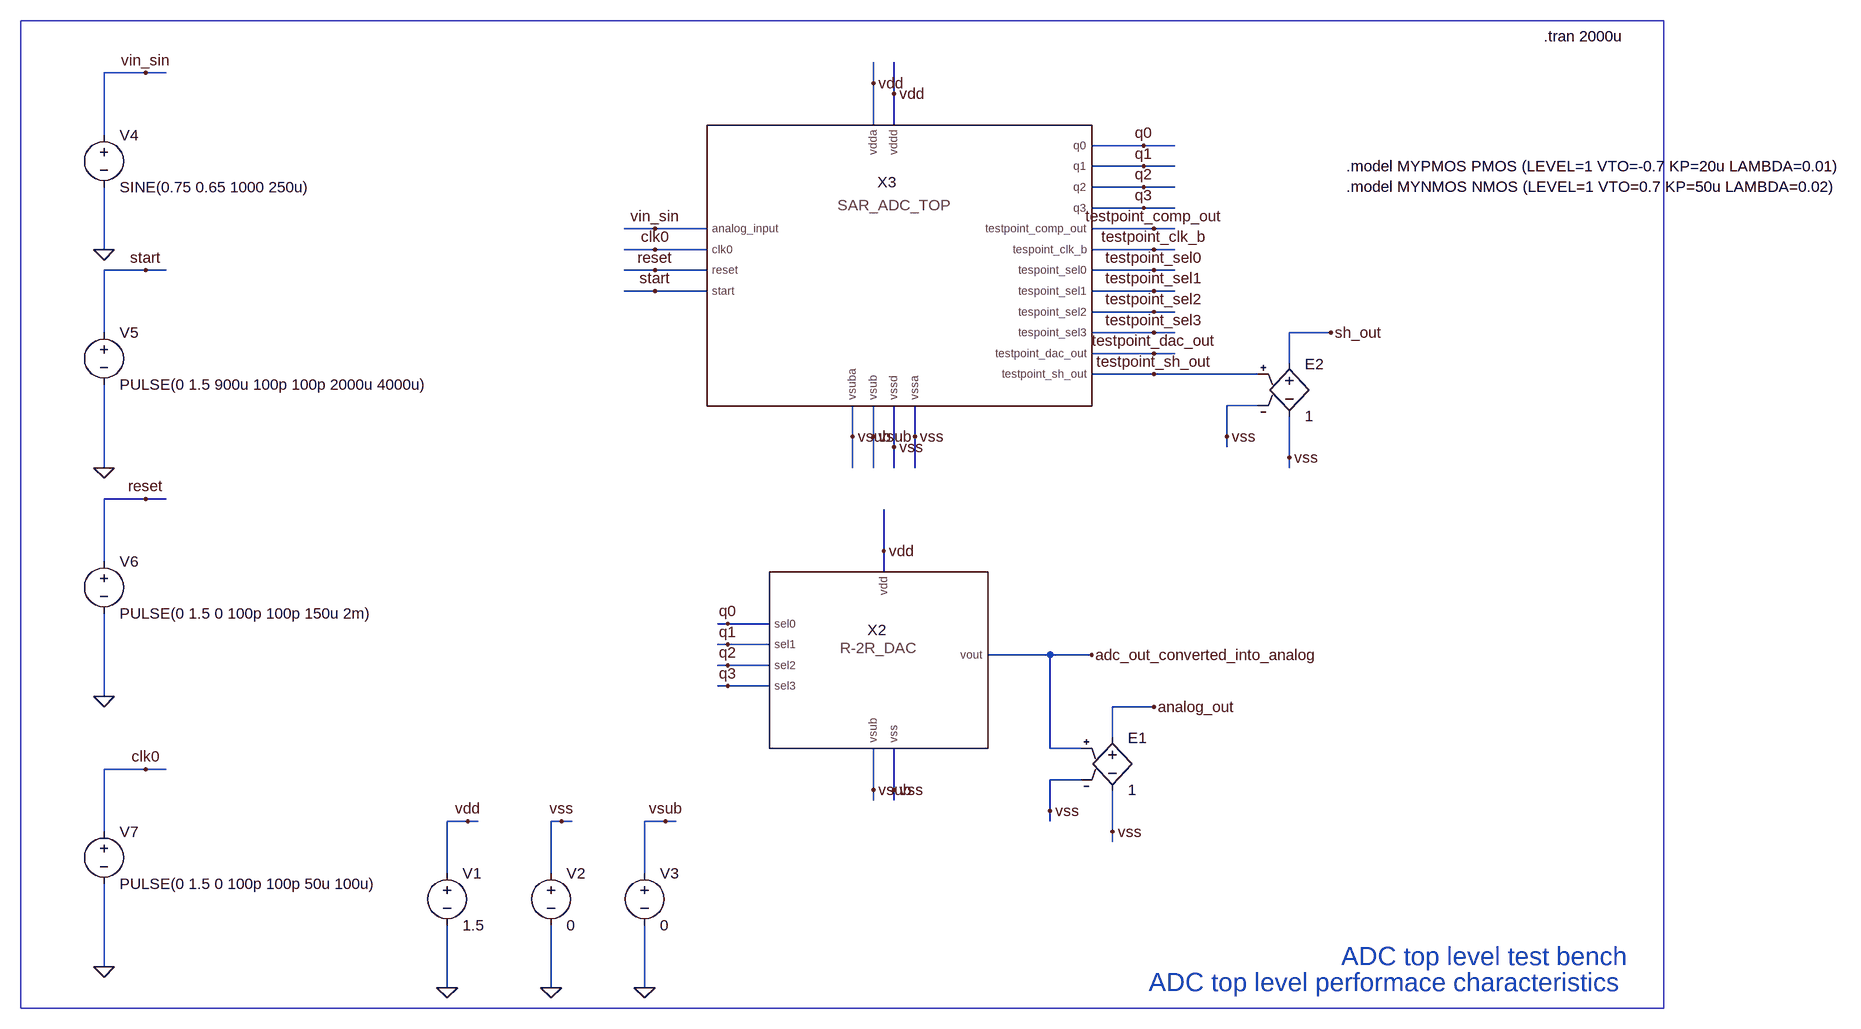
[diagram p0: schematic dsproj_adctop_perfCharacterisitcs.asc]
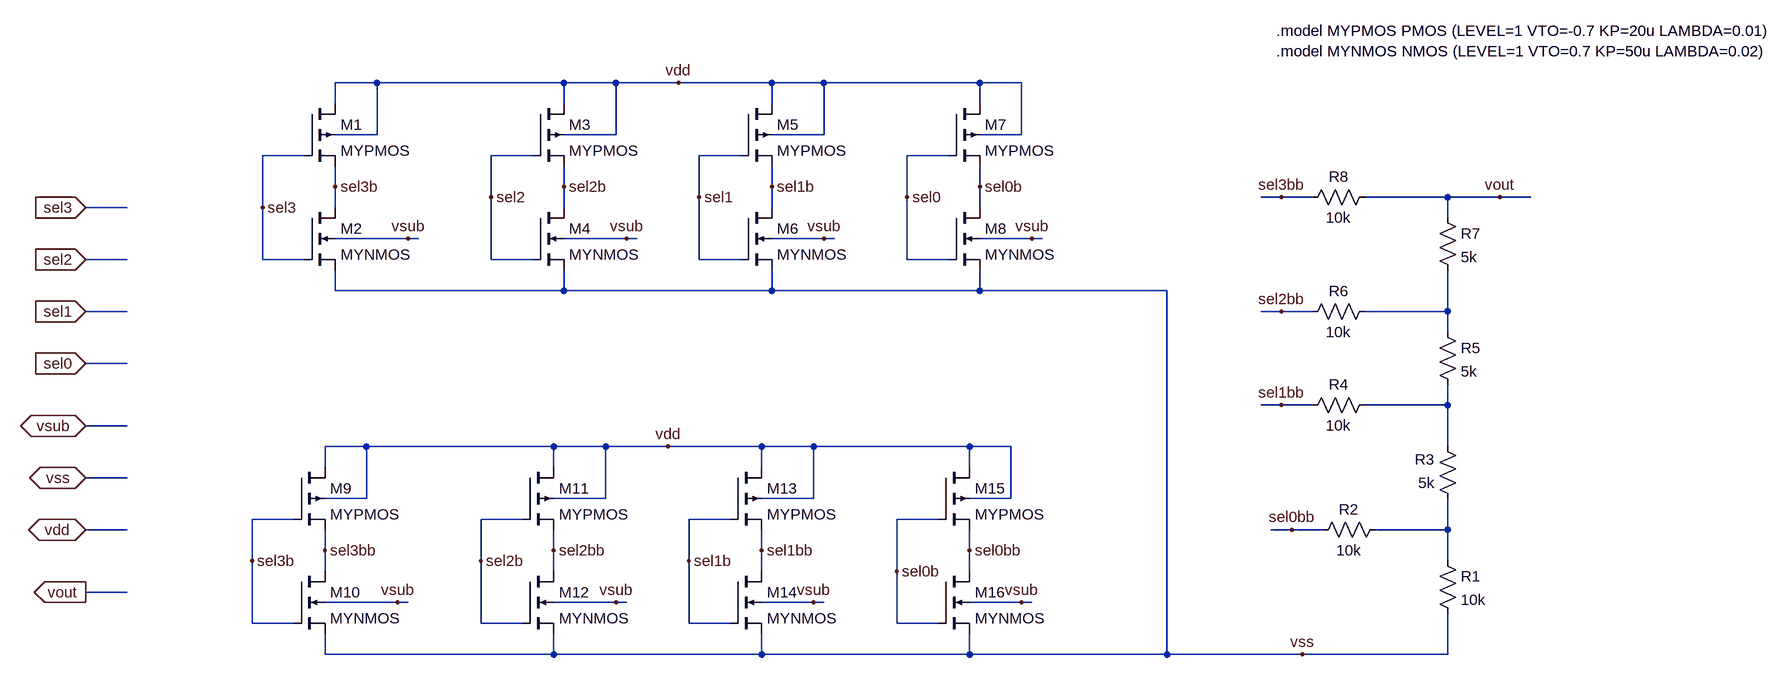
[diagram p1: sub-circuit dsproj_r2rdac.asc]
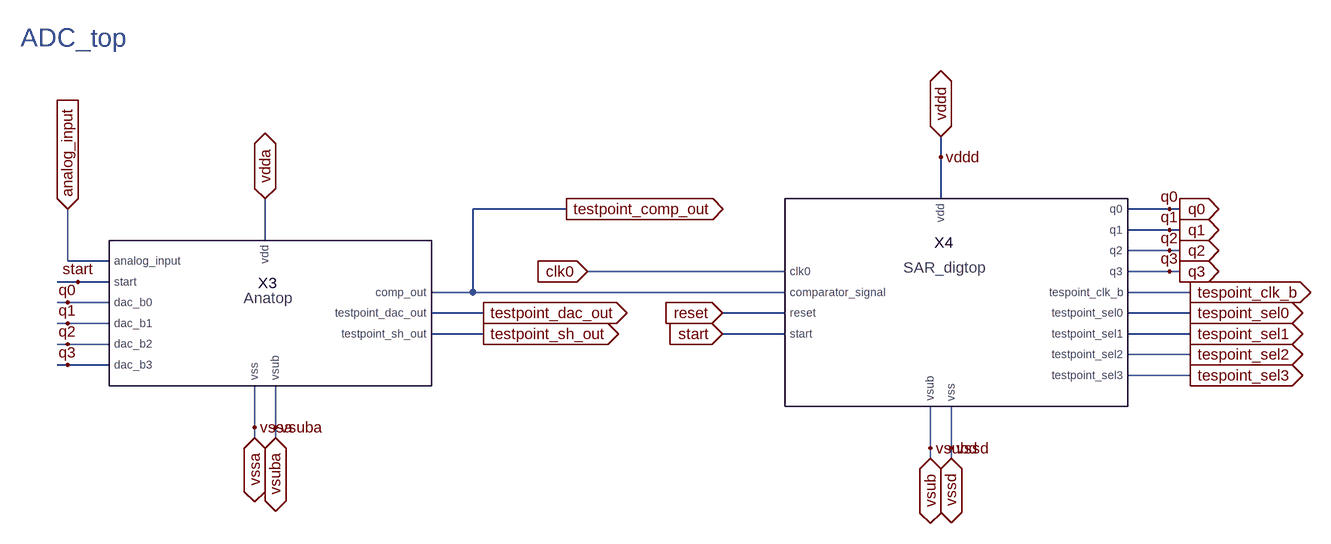
[diagram p2: sub-circuit dsproj_adctop.asc]
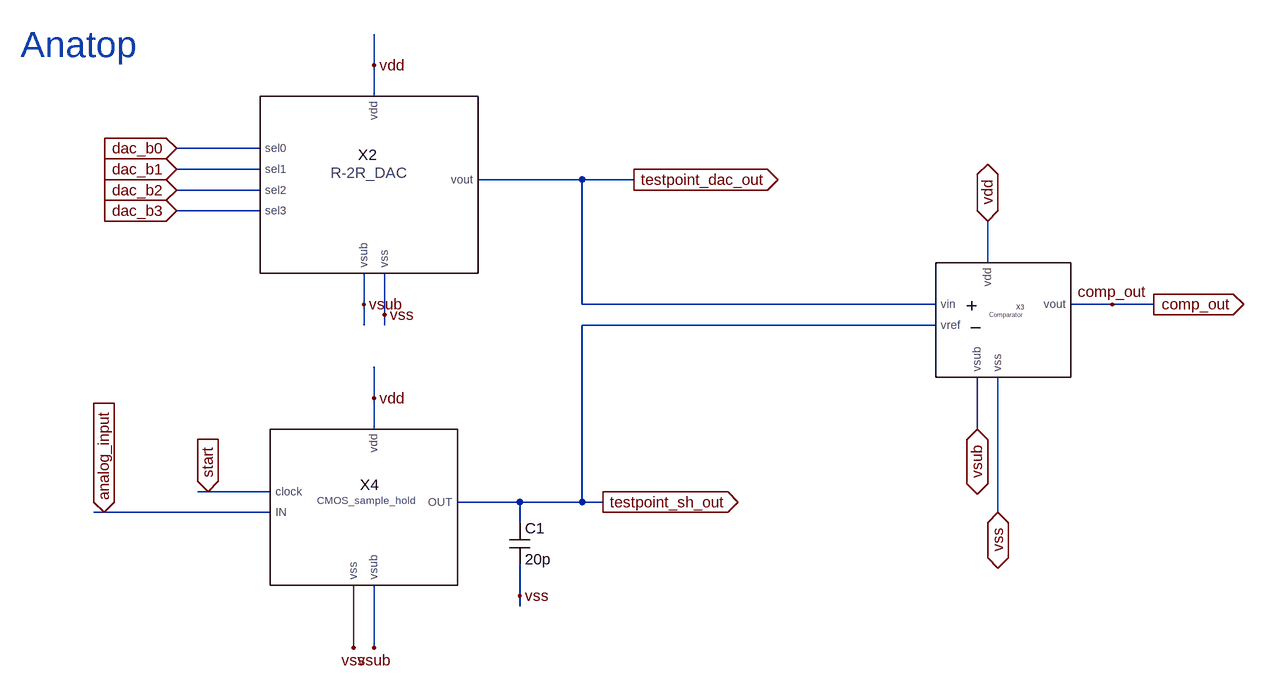
[diagram p3: sub-circuit dsproj_anatop.asc]
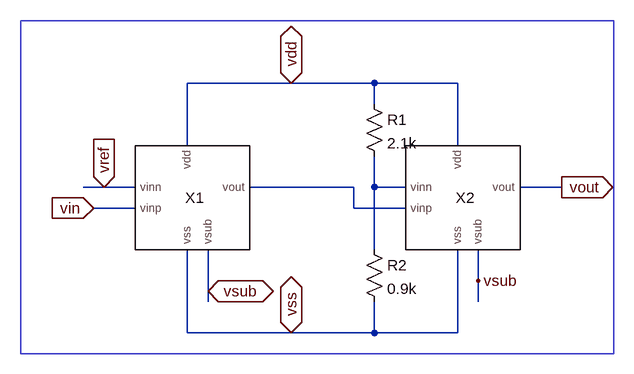
[diagram p4: sub-circuit dsproj_twostagecomparator.asc]
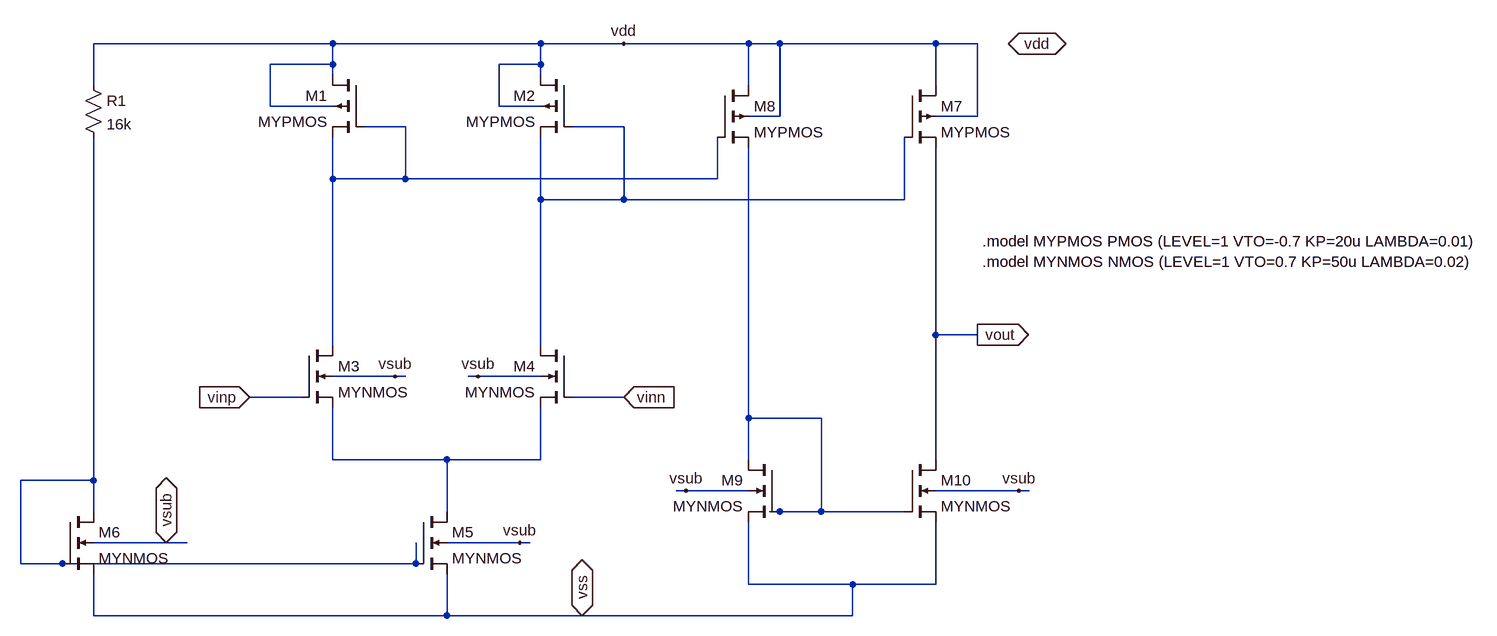
[diagram p5: sub-circuit dsproj_nmos_comparator.asc]
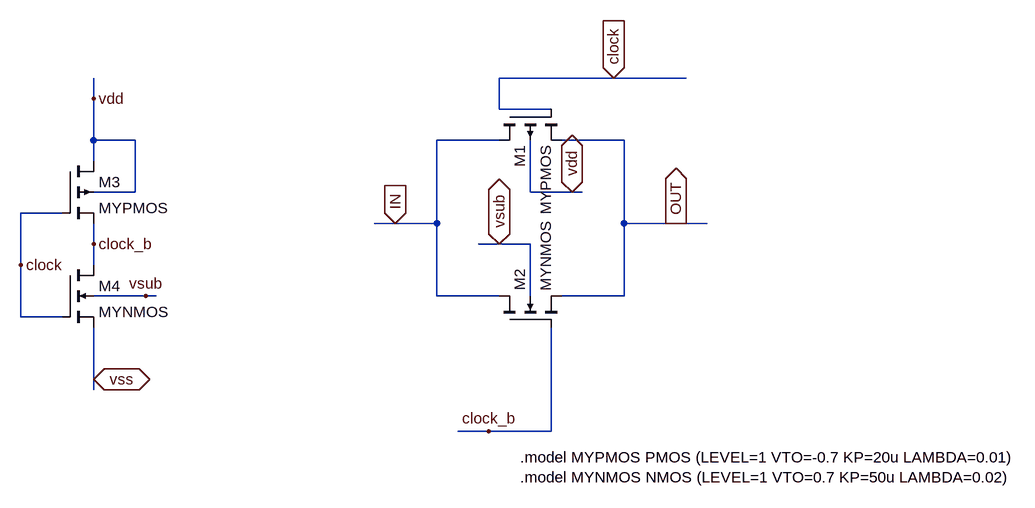
[diagram p6: sub-circuit dsproj_cmossampleandhold.asc]
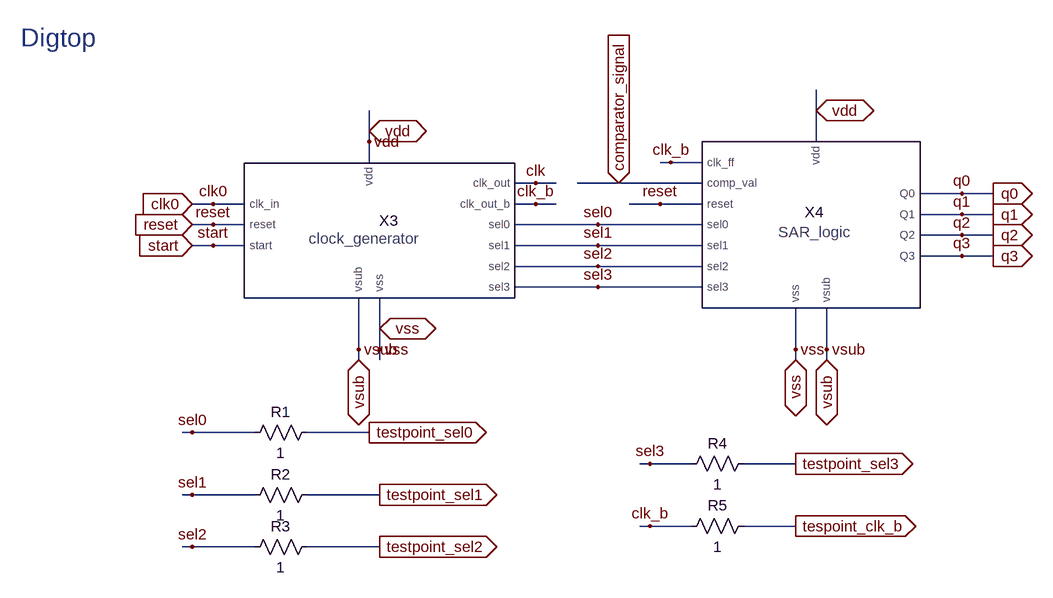
[diagram p7: sub-circuit dsproj_digtop.asc]
dsproj_adctop_perfCharacterisitcs.asc, the LTspice schematic file:
Version 4.1
SHEET 1 1408 788
WIRE -1232 -656 -1296 -656
WIRE -1200 -656 -1232 -656
WIRE -112 -640 -112 -672
WIRE -80 -624 -80 -672
WIRE -112 -576 -112 -640
WIRE -80 -576 -80 -624
WIRE -1296 -560 -1296 -656
WIRE 304 -544 224 -544
WIRE 352 -544 304 -544
WIRE 304 -512 224 -512
WIRE 352 -512 304 -512
WIRE 304 -480 224 -480
WIRE 352 -480 304 -480
WIRE 304 -448 224 -448
WIRE 352 -448 304 -448
WIRE -448 -416 -496 -416
WIRE -368 -416 -448 -416
WIRE 320 -416 224 -416
WIRE 352 -416 320 -416
WIRE -1296 -384 -1296 -480
WIRE -448 -384 -496 -384
WIRE -368 -384 -448 -384
WIRE 320 -384 224 -384
WIRE 352 -384 320 -384
WIRE -1232 -352 -1296 -352
WIRE -1200 -352 -1232 -352
WIRE -448 -352 -496 -352
WIRE -368 -352 -448 -352
WIRE 320 -352 224 -352
WIRE 352 -352 320 -352
WIRE -448 -320 -496 -320
WIRE -368 -320 -448 -320
WIRE 320 -320 224 -320
WIRE 352 -320 320 -320
WIRE 320 -288 224 -288
WIRE 352 -288 320 -288
WIRE -1296 -256 -1296 -352
WIRE 320 -256 224 -256
WIRE 352 -256 320 -256
WIRE 592 -256 528 -256
WIRE 320 -224 224 -224
WIRE 352 -224 320 -224
WIRE 528 -208 528 -256
WIRE 320 -192 224 -192
WIRE 480 -192 320 -192
WIRE 480 -144 432 -144
WIRE -144 -96 -144 -144
WIRE -112 -96 -112 -144
WIRE -48 -96 -48 -144
WIRE 432 -96 432 -144
WIRE -80 -80 -80 -144
WIRE 432 -80 432 -96
WIRE 528 -64 528 -128
WIRE -1296 -48 -1296 -176
WIRE -144 -48 -144 -96
WIRE -112 -48 -112 -96
WIRE -80 -48 -80 -80
WIRE -48 -48 -48 -96
WIRE 528 -48 528 -64
WIRE -1232 0 -1296 0
WIRE -1200 0 -1232 0
WIRE -96 80 -96 16
WIRE -1296 96 -1296 0
WIRE -96 112 -96 80
WIRE -336 192 -352 192
WIRE -272 192 -336 192
WIRE -336 224 -352 224
WIRE -272 224 -336 224
WIRE 160 240 64 240
WIRE 224 240 160 240
WIRE -336 256 -352 256
WIRE -272 256 -336 256
WIRE -336 288 -352 288
WIRE -272 288 -336 288
WIRE -1296 304 -1296 176
WIRE 320 320 256 320
WIRE 256 368 256 320
WIRE 160 384 160 240
WIRE 208 384 160 384
WIRE -1232 416 -1296 416
WIRE -1200 416 -1232 416
WIRE 208 432 160 432
WIRE -112 448 -112 384
WIRE -80 448 -80 384
WIRE -112 464 -112 448
WIRE -80 464 -80 448
WIRE 160 480 160 432
WIRE -736 496 -768 496
WIRE -720 496 -736 496
WIRE -592 496 -608 496
WIRE -576 496 -592 496
WIRE -432 496 -464 496
WIRE -416 496 -432 496
WIRE 160 496 160 480
WIRE -1296 512 -1296 416
WIRE 256 512 256 448
WIRE 256 528 256 512
WIRE -768 576 -768 496
WIRE -608 576 -608 496
WIRE -464 576 -464 496
WIRE -1296 720 -1296 592
WIRE -768 752 -768 656
WIRE -608 752 -608 656
WIRE -464 752 -464 656
FLAG -768 752 0
FLAG -608 752 0
FLAG -464 752 0
FLAG -736 496 vdd
FLAG -592 496 vss
FLAG -432 496 vsub
FLAG -112 -640 vdd
FLAG -80 -624 vdd
FLAG -144 -96 vsub
FLAG -112 -96 vsub
FLAG -80 -80 vss
FLAG -48 -96 vss
FLAG 304 -544 q0
FLAG 304 -512 q1
FLAG 304 -480 q2
FLAG 304 -448 q3
FLAG 320 -384 testpoint_clk_b
FLAG 320 -352 testpoint_sel0
FLAG 320 -320 testpoint_sel1
FLAG 320 -288 testpoint_sel2
FLAG 320 -256 testpoint_sel3
FLAG 320 -224 testpoint_dac_out
FLAG 320 -192 testpoint_sh_out
FLAG 320 -416 testpoint_comp_out
FLAG -448 -416 vin_sin
FLAG -448 -384 clk0
FLAG -448 -352 reset
FLAG -448 -320 start
FLAG -1296 -384 0
FLAG -1232 -656 vin_sin
FLAG -1296 -48 0
FLAG -1232 -352 start
FLAG -1296 304 0
FLAG -1232 0 reset
FLAG -1296 720 0
FLAG -1232 416 clk0
FLAG -336 192 q0
FLAG -336 224 q1
FLAG -336 256 q2
FLAG -336 288 q3
FLAG -96 80 vdd
FLAG -112 448 vsub
FLAG -80 448 vss
FLAG 224 240 adc_out_converted_into_analog
FLAG 160 480 vss
FLAG 256 512 vss
FLAG 320 320 analog_out
FLAG 432 -96 vss
FLAG 528 -64 vss
FLAG 592 -256 sh_out
SYMBOL voltage -768 560 R0
WINDOW 123 0 0 Left 0
WINDOW 39 0 0 Left 0
SYMATTR InstName V1
SYMATTR Value 1.5
SYMBOL voltage -608 560 R0
WINDOW 123 0 0 Left 0
WINDOW 39 0 0 Left 0
SYMATTR InstName V2
SYMATTR Value 0
SYMBOL voltage -464 560 R0
WINDOW 123 0 0 Left 0
WINDOW 39 0 0 Left 0
SYMATTR InstName V3
SYMATTR Value 0
SYMBOL voltage -1296 -576 R0
WINDOW 123 0 0 Left 0
WINDOW 39 0 0 Left 0
SYMATTR InstName V4
SYMATTR Value SINE(0.75 0.65 1000 250u)
SYMBOL voltage -1296 -272 R0
WINDOW 123 0 0 Left 0
WINDOW 39 0 0 Left 0
SYMATTR InstName V5
SYMATTR Value PULSE(0 1.5 900u 100p 100p 2000u 4000u)
SYMBOL voltage -1296 80 R0
WINDOW 123 0 0 Left 0
WINDOW 39 0 0 Left 0
SYMATTR InstName V6
SYMATTR Value PULSE(0 1.5 0 100p 100p 150u 2m)
SYMBOL voltage -1296 496 R0
WINDOW 123 0 0 Left 0
WINDOW 39 0 0 Left 0
SYMATTR InstName V7
SYMATTR Value PULSE(0 1.5 0 100p 100p 50u 100u)
SYMBOL dsproj_r2rdac -176 320 R0
SYMATTR InstName X2
SYMBOL e 256 352 R0
SYMATTR InstName E1
SYMATTR Value 1
SYMBOL e 528 -224 R0
SYMATTR InstName E2
SYMATTR Value 1
SYMBOL dsproj_adctop -128 -352 R0
SYMATTR InstName X3
TEXT 920 -712 Left 2 !.tran 2000u
TEXT 608 704 Left 4 ;ADC top level test bench
TEXT 312 744 Left 4 ;ADC top level performace characteristics
TEXT 616 -512 Left 2 !.model MYPMOS PMOS (LEVEL=1 VTO=-0.7 KP=20u LAMBDA=0.01)\n.model MYNMOS NMOS (LEVEL=1 VTO=0.7 KP=50u LAMBDA=0.02)
RECTANGLE Normal 1104 784 -1424 -736

The netlist it stands for:
* dsproj_adctop_perfCharacterisitcs.asc
V1 vdd 0 1.5
V2 vss 0 0
V3 vsub 0 0
V4 vin_sin 0 SINE(0.75 0.65 1000 250u)
V5 start 0 PULSE(0 1.5 900u 100p 100p 2000u 4000u)
V6 reset 0 PULSE(0 1.5 0 100p 100p 150u 2m)
V7 clk0 0 PULSE(0 1.5 0 100p 100p 50u 100u)
X§X2 q0 q1 q2 q3 vdd adc_out_converted_into_analog vss vsub dsproj_r2rdac
E1 analog_out vss adc_out_converted_into_analog vss 1
E2 sh_out vss testpoint_sh_out vss 1
X§X3 vin_sin clk0 reset start testpoint_clk_b testpoint_sel0 testpoint_sel1 testpoint_sel2 testpoint_sel3 testpoint_dac_out testpoint_sh_out vdd vdd vss vss vsub vsub q0 q1 q2 q3 testpoint_comp_out dsproj_adctop

* block symbol definitions
.subckt dsproj_r2rdac sel0 sel1 sel2 sel3 vdd vout vss vsub
M1 vdd sel3 sel3b vdd MYPMOS l=180e-9 w=2.4e-6
M2 sel3b sel3 vss vsub MYNMOS l=180e-9 w=1.2e-6
M3 vdd sel2 sel2b vdd MYPMOS l=180e-9 w=2.4e-6 m=1
M4 sel2b sel2 vss vsub MYNMOS l=180e-9 w=1.2e-6 m=1
M5 vdd sel1 sel1b vdd MYPMOS l=180e-9 w=2.4e-6 m=1
M6 sel1b sel1 vss vsub MYNMOS l=180e-9 w=1.2e-6 m=1
M7 vdd sel0 sel0b vdd MYPMOS l=180e-9 w=2.4e-6 m=1
M8 sel0b sel0 vss vsub MYNMOS l=180e-9 w=1.2e-6 m=1
M9 vdd sel3b sel3bb vdd MYPMOS l=180e-9 w=2.4e-6 m=1
M10 sel3bb sel3b vss vsub MYNMOS l=180e-9 w=1.2e-6 m=1
M11 vdd sel2b sel2bb vdd MYPMOS l=180e-9 w=2.4e-6 m=1
M12 sel2bb sel2b vss vsub MYNMOS l=180e-9 w=1.2e-6 m=1
M13 vdd sel1b sel1bb vdd MYPMOS l=180e-9 w=2.4e-6 m=1
M14 sel1bb sel1b vss vsub MYNMOS l=180e-9 w=1.2e-6 m=1
M15 vdd sel0b sel0bb vdd MYPMOS l=180e-9 w=2.4e-6 m=1
M16 sel0bb sel0b vss vsub MYNMOS l=180e-9 w=1.2e-6 m=1
R1 N003 vss 10k
R2 N003 sel0bb 10k
R3 N003 N002 5k
R4 sel1bb N002 10k
R5 N001 N002 5k
R6 N001 sel2bb 10k
R7 vout N001 5k
R8 vout sel3bb 10k
.model MYPMOS PMOS (LEVEL=1 VTO=-0.7 KP=20u LAMBDA=0.01)
.model MYNMOS NMOS (LEVEL=1 VTO=0.7 KP=50u LAMBDA=0.02)
.ends dsproj_r2rdac

.subckt dsproj_adctop analog_input clk0 reset start tespoint_clk_b tespoint_sel0 tespoint_sel1 tespoint_sel2 tespoint_sel3 testpoint_dac_out testpoint_sh_out vdda vddd vssa vssd vsub vsuba q0 q1 q2 q3 testpoint_comp_out
X§X3 analog_input q0 q1 q2 q3 testpoint_comp_out testpoint_dac_out testpoint_sh_out vdda vssa vsuba start dsproj_anatop
X§X4 clk0 testpoint_comp_out reset start q0 q1 q2 q3 tespoint_clk_b tespoint_sel0 tespoint_sel1 tespoint_sel2 tespoint_sel3 vddd vssd vsub dsproj_digtop
* ADC_top
.ends dsproj_adctop

.subckt dsproj_anatop analog_input dac_b0 dac_b1 dac_b2 dac_b3 comp_out testpoint_dac_out testpoint_sh_out vdd vss vsub start
X§X2 dac_b0 dac_b1 dac_b2 dac_b3 vdd testpoint_dac_out vss vsub dsproj_r2rdac
X§X3 testpoint_dac_out testpoint_sh_out vdd comp_out vss vsub dsproj_twostagecomparator
C1 testpoint_sh_out vss 20p
X§X4 analog_input start testpoint_sh_out vdd vsub vss dsproj_cmossampleandhold
* Anatop
.ends dsproj_anatop

.subckt dsproj_twostagecomparator vin vref vdd vout vss vsub
XX1 vref vin vdd N001 vss vsub dsproj_nmos_comparator
XX2 N002 N001 vdd vout vss vsub dsproj_nmos_comparator
R1 vdd N002 2.1k
R2 N002 vss 0.9k
.ends dsproj_twostagecomparator

.subckt dsproj_nmos_comparator vinn vinp vdd vout vss vsub
M1 vdd N001 N001 vdd MYPMOS l=180e-9 w=1.2e-6 m=2
M2 vdd N002 N002 vdd MYPMOS l=180e-9 w=1.2e-6 m=2
M4 N002 vinn N004 vsub MYNMOS l=180e-9 w=1.2e-6 m=3
M5 N004 N005 vss vsub MYNMOS l=3e-6 w=10e-6 m=2
R1 vdd N005 16k
M6 N005 N005 vss vsub MYNMOS l=3e-6 w=10e-6 m=2
M3 N001 vinp N004 vsub MYNMOS l=180e-9 w=1.2e-6 m=3
M7 vdd N002 vout vdd MYPMOS l=180e-9 w=1.2e-6 m=2
M8 vdd N001 N003 vdd MYPMOS l=180e-9 w=1.2e-6 m=2
M9 N003 N003 vss vsub MYNMOS l=180e-9 w=1.2e-6 m=1
M10 vout N003 vss vsub MYNMOS l=180e-9 w=1.2e-6 m=1
.model MYPMOS PMOS (LEVEL=1 VTO=-0.7 KP=20u LAMBDA=0.01)
.model MYNMOS NMOS (LEVEL=1 VTO=0.7 KP=50u LAMBDA=0.02)
.ends dsproj_nmos_comparator

.subckt dsproj_cmossampleandhold IN clock OUT vdd vsub vss
M1 IN clock OUT vdd MYPMOS l=180e-9 w=2400e-9
M2 IN clock_b OUT vsub MYNMOS l=180e-9 w=1200e-9
M3 vdd clock clock_b vdd MYPMOS l=180e-9 w=2.4e-6 m=1
M4 clock_b clock vss vsub MYNMOS l=180e-9 w=1.2e-6 m=1
.model MYPMOS PMOS (LEVEL=1 VTO=-0.7 KP=20u LAMBDA=0.01)
.model MYNMOS NMOS (LEVEL=1 VTO=0.7 KP=50u LAMBDA=0.02)
.ends dsproj_cmossampleandhold

.subckt dsproj_digtop clk0 comparator_signal reset start q0 q1 q2 q3 tespoint_clk_b testpoint_sel0 testpoint_sel1 testpoint_sel2 testpoint_sel3 vdd vss vsub
R1 testpoint_sel0 sel0 1
R2 testpoint_sel1 sel1 1
R3 testpoint_sel2 sel2 1
R4 testpoint_sel3 sel3 1
R5 tespoint_clk_b clk_b 1
X§X3 clk0 reset start clk clk_b sel0 sel1 sel2 sel3 vdd vss vsub dsproj_clkgenerator
X§X4 clk_b comparator_signal reset sel0 sel1 sel2 sel3 q0 q1 q2 q3 vsub vss vdd dsproj_sarlogicblock
* Digtop
.ends dsproj_digtop

.subckt dsproj_clkgenerator clk_in reset start clk_out clk_out_b sel0 sel1 sel2 sel3 vdd vss vsub
X§X1 start clr_ff1 start_d vss start_ff NC_01 vdd vss vsub dsproj_dff
X§X2 clk_ff reset start_ff vss sel3 NC_02 vdd vss vsub dsproj_dff
X§X3 clk_ff reset sel3 vss sel2 NC_03 vdd vss vsub dsproj_dff
X§X4 clk_ff reset sel2 vss sel1 NC_04 vdd vss vsub dsproj_dff
X§X5 clk_ff reset sel1 vss sel0 NC_05 vdd vss vsub dsproj_dff
X§X6 clk_in reset N002 vss clk_ff NC_06 vdd vss vsub dsproj_dff
R1 sel0 0 100e3
A1 start_ff 0 0 0 0 start_d 0 0 BUF
A2 clk_ff 0 0 0 0 N002 0 0 BUF
A3 0 sel3 reset 0 0 0 clr_ff1 0 OR
A4 clk_in 0 0 0 0 clk_out_b 0 0 BUF
A5 clk_out_b 0 0 0 0 clk_out 0 0 BUF
.model MYPMOS PMOS (LEVEL=1 VTO=-0.7 KP=20u LAMBDA=0.01)
.model MYNMOS NMOS (LEVEL=1 VTO=0.7 KP=50u LAMBDA=0.02)
.ends dsproj_clkgenerator

.subckt dsproj_dff CLK CLR D PRE Q Qb vdd vss vsub
A1 N004 0 N005 PRE N010 N006 N001 0 DFLOP
M1 vdd N003 N004 vdd MYPMOS l=180e-9 w=2400e-9
M2 N004 N003 vss vsub MYNMOS l=180e-9 w=1200e-9
M3 vdd D N003 vdd MYPMOS l=180e-9 w=2400e-9
M4 N003 D vss vsub MYNMOS l=180e-9 w=1200e-9
M5 vdd N007 N005 vdd MYPMOS l=180e-9 w=2400e-9
M6 N005 N007 vss vsub MYNMOS l=180e-9 w=1200e-9
M7 vdd CLK N007 vdd MYPMOS l=180e-9 w=2400e-9
M8 N007 CLK vss vsub MYNMOS l=180e-9 w=1200e-9
M9 vdd N002 Q vdd MYPMOS l=180e-9 w=2400e-9
M10 Q N002 vss vsub MYNMOS l=180e-9 w=1200e-9
M11 vdd N001 N002 vdd MYPMOS l=180e-9 w=2400e-9
M12 N002 N001 vss vsub MYNMOS l=180e-9 w=1200e-9
M13 vdd N008 Qb vdd MYPMOS l=180e-9 w=2400e-9
M14 Qb N008 vss vsub MYNMOS l=180e-9 w=1200e-9
M15 vdd N006 N008 vdd MYPMOS l=180e-9 w=2400e-9
M16 N008 N006 vss vsub MYNMOS l=180e-9 w=1200e-9
M17 vdd N009 N010 vdd MYPMOS l=180e-9 w=2400e-9
M18 N010 N009 vss vsub MYNMOS l=180e-9 w=1200e-9
M19 vdd CLR N009 vdd MYPMOS l=180e-9 w=2400e-9
M20 N009 CLR vss vsub MYNMOS l=180e-9 w=1200e-9
.tran 200
.model MYPMOS PMOS (LEVEL=1 VTO=-0.7 KP=20u LAMBDA=0.01)
.model MYNMOS NMOS (LEVEL=1 VTO=0.7 KP=50u LAMBDA=0.02)
.ends dsproj_dff

.subckt dsproj_sarlogicblock clk_ff comp_val reset sel0 sel1 sel2 sel3 Q0 Q1 Q2 Q3 vsub vss vdd
X§X1 comp_val N001 sel0 vsub N002 vdd vss dsproj_2to1mux
X§X2 clk_ff_0 reset N002 vss Q0 NC_01 vdd vss vsub dsproj_dff
A1 Q0 0 0 0 0 N001 0 0 BUF
X§X3 comp_val N003 sel1 vsub N004 vdd vss dsproj_2to1mux
X§X4 clk_ff_1 reset N004 vss Q1 NC_02 vdd vss vsub dsproj_dff
A2 Q1 0 0 0 0 N003 0 0 BUF
X§X5 comp_val N005 sel2 vsub N006 vdd vss dsproj_2to1mux
X§X6 clk_ff_2 reset N006 vss Q2 NC_03 vdd vss vsub dsproj_dff
A3 Q2 0 0 0 0 N005 0 0 BUF
X§X7 comp_val N007 sel3 vsub N008 vdd vss dsproj_2to1mux
X§X8 clk_ff_3 reset N008 vss Q3 NC_04 vdd vss vsub dsproj_dff
A4 Q3 0 0 0 0 N007 0 0 BUF
A5 0 sel0 clk_ff vdd 0 0 clk_ff_0 0 AND
A6 0 sel1 clk_ff vdd 0 0 clk_ff_1 0 AND
A7 0 sel2 clk_ff vdd 0 0 clk_ff_2 0 AND
A8 0 sel3 clk_ff vdd 0 0 clk_ff_3 0 AND
.model MYPMOS PMOS (LEVEL=1 VTO=-0.7 KP=20u LAMBDA=0.01)
.model MYNMOS NMOS (LEVEL=1 VTO=0.7 KP=50u LAMBDA=0.02)
.ends dsproj_sarlogicblock

.subckt dsproj_2to1mux A B sela vsub out vdd vss
M1 vdd sela_b sela_bb vdd MYPMOS l=180e-9 w=2400e-9
M2 sela_bb sela_b vss vsub MYNMOS l=180e-9 w=1200e-9
M3 vdd sela sela_b vdd MYPMOS l=180e-9 w=2400e-9
M4 sela_b sela vss vsub MYNMOS l=180e-9 w=1200e-9
M5 N002 B out vdd MYPMOS l=180e-9 w=2400e-9
M6 out B N003 vsub MYNMOS l=180e-9 w=1200e-9
M7 N001 A out vdd MYPMOS l=180e-9 w=2400e-9
M8 out A N004 vsub MYNMOS l=180e-9 w=1200e-9
M9 vdd sela_b N001 vdd MYPMOS l=180e-9 w=2400e-9
M10 N004 sela_bb vss vsub MYNMOS l=180e-9 w=1200e-9
M11 vdd sela_bb N002 vdd MYPMOS l=180e-9 w=2400e-9
M12 N003 sela_b vss vsub MYNMOS l=180e-9 w=1200e-9
* 2-to-1-Mux
.model MYPMOS PMOS (LEVEL=1 VTO=-0.7 KP=20u LAMBDA=0.01)
.model MYNMOS NMOS (LEVEL=1 VTO=0.7 KP=50u LAMBDA=0.02)
.ends dsproj_2to1mux

.model NMOS NMOS
.model PMOS PMOS
.lib standard.mos
.tran 2000u
* ADC top level test bench
* ADC top level performace characteristics
.model MYPMOS PMOS (LEVEL=1 VTO=-0.7 KP=20u LAMBDA=0.01)
.model MYNMOS NMOS (LEVEL=1 VTO=0.7 KP=50u LAMBDA=0.02)
.backanno
.end